# EasyEDA Pro project PCB-print.eprj

# Schematic pi
Board Name: pi; Create Date: 2025-05-02; Page Name: Version2; Project Name: pi; Schematic Name: pi; Update Date: 2025-05-10; Add into BOM: yes; Company: ----; Convert to PCB: yes; Date: 2024-08-29; Draw By: Vlasiuk Dmitro; REV: 2.1; Sheet: 1/1; spicePre: .
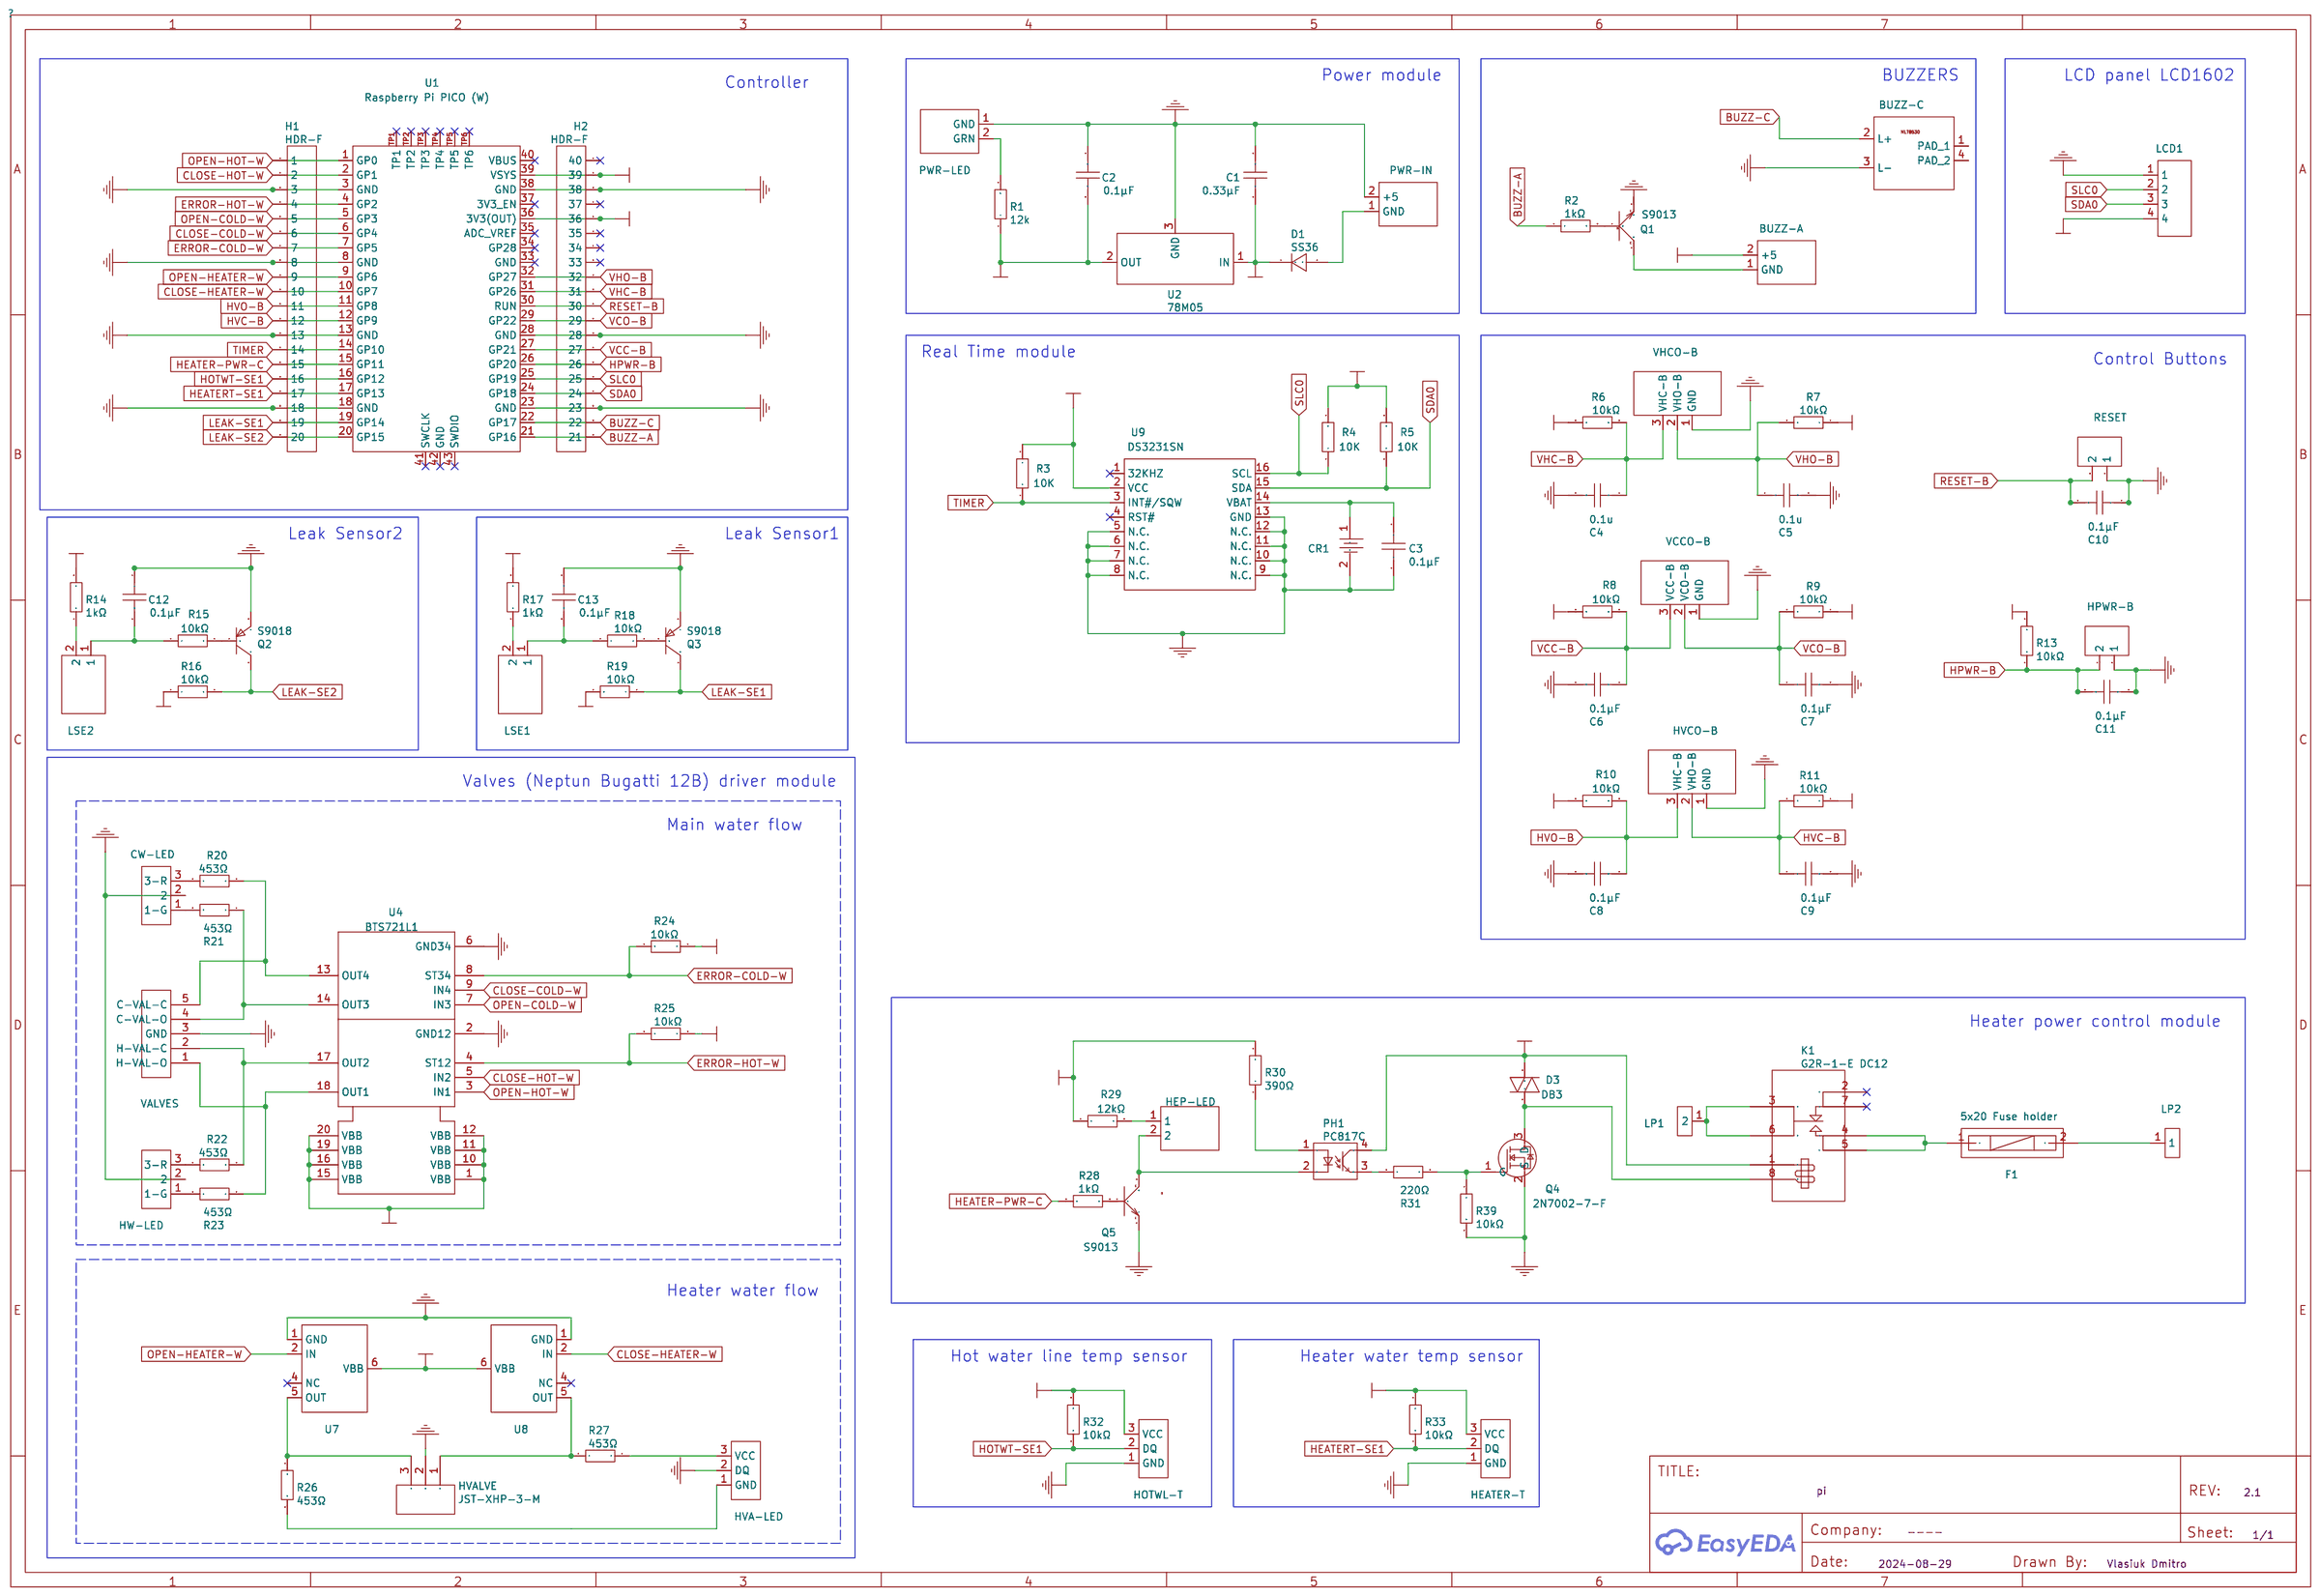
[diagram p0: schematic sheet]

## Parts
BUZZ-A  KF2510
BUZZ-C  BUZZER-MLT8580_MLT-8530
C1  0.33μF
C2  0.1μF
C3  0.1μF
C4  0.1u
C5  0.1u
C6  0.1μF
C7  0.1μF
C8  0.1μF
C9  0.1μF
C10  0.1μF
C11  0.1μF
C12  0.1μF
C13  0.1μF
CR1  KH-CR1220-2
CW-LED  CONN-TH_KF2510-3A
D1  SS36
D3  DB3
F1  5x20 Fuse holder
H1  HDR-F
H2  HDR-F
HEATER-T  CONN-TH_KF2510-3A
HEP-LED  KF2510
HOTWL-T  CONN-TH_KF2510-3A
HPWR-B  HDR-M-2.54_1x2
HVA-LED  CONN-TH_KF2510-3A
HVALVE  JST-XHP-3-M
HVCO-B  HDR-M-2.54_1x3
HW-LED  CONN-TH_KF2510-3A
K1  G2R-1-E DC12
LCD1  TERMINAL_KF2510-4A-
LP1  PCB Spade Terminal - 5.08
LP2  PCB Spade Terminal - 5.08
LSE1  KF2510
LSE2  KF2510
PH1  PC817C
PWR-IN  KF2510
PWR-LED  KF2510
Q1  S9013
Q2  S9018
Q3  S9018
Q4  2N7002-7-F
Q5  S9013
R1  12k
R2  1kΩ
R3  10К
R4  10К
R5  10К
R6  10kΩ
R7  10kΩ
R8  10kΩ
R9  10kΩ
R10  10kΩ
R11  10kΩ
R13  10kΩ
R14  1kΩ
R15  10kΩ
R16  10kΩ
R17  1kΩ
R18  10kΩ
R19  10kΩ
R20  453Ω
R21  453Ω
R22  453Ω
R23  453Ω
R24  10kΩ
R25  10kΩ
R26  453Ω
R27  453Ω
R28  1kΩ
R29  12kΩ
R30  390Ω
R31  220Ω
R32  10kΩ
R33  10kΩ
R39  10kΩ
RESET  HDR-M-2.54_1x2
U1  Raspberry Pi PICO (W)
U2  78M05
U4  BTS721L1
U7  BTS452TATMA1_C5309408
U8  BTS452TATMA1_C5309408
U9  DS3231SN
VALVES  JST-XHP-5-M
VCCO-B  HDR-M-2.54_1x3
VHCO-B  HDR-M-2.54_1x3

## Library data of the parts
BUZZ-A HEP-LED LSE1 LSE2 PWR-IN PWR-LED = KF2510: link: https://www.aliexpress.com/item/1005004114019589.html?spm=a2g0o.order_detail.order_detail_item.13.24e4f19c9nkOaD; Contributor: ryan.yulianto; spicePre: C; spiceSymbolName: B2B-XH-AM (LF)(SN)
BUZZ-C = BUZZER-MLT8580_MLT-8530: Contributor: Paul Walker; spicePre: L; Package Display: No
C1 = 0.33μF: Manufacturer Part: C0805X104K050T; link: https://www.aliexpress.com/item/1005005443849072.html?spm=a2g0o.order_detail.order_detail_item.3.69d8f19csxdjfb; nameAlias: Value; Contributor: LCSC; spicePre: C; spiceSymbolName: C0805-100NF
C2 C3 C6-C13 = 0.1μF: Manufacturer Part: C0805X104K050T; link: https://www.aliexpress.com/item/1005005443849072.html?spm=a2g0o.order_detail.order_detail_item.3.69d8f19csxdjfb; nameAlias: Value; Contributor: LCSC; spicePre: C; spiceSymbolName: C0805-100NF
C4 C5 = 0.1u: Manufacturer Part: C0805X104K050T; link: https://www.aliexpress.com/item/1005005443849072.html?spm=a2g0o.order_detail.order_detail_item.3.69d8f19csxdjfb; nameAlias: Value; Contributor: LCSC; spicePre: C; spiceSymbolName: C0805-100NF
CR1 = KH-CR1220-2: Supplier: LCSC; Supplier Part: C5365933; Manufacturer: kinghelm(金航标); JLCPCB Part Class: Extended Part; Contributor: lcsc; spicePre: U
CW-LED = CONN-TH_KF2510-3A: Manufacturer Part: KF2510; image: //image.lceda.cn/szlcsc/C29275.jpg; spicePre: X
D1 = SS36: Supplier Part: C143203; Supplier: LCSC; Manufacturer: FMS(美丽微); Manufacturer Part: SS36-A; JLCPCB Part Class: Extended Part; Contributor: LCSC; spicePre: D; spiceSymbolName: SS36-A
D3 = DB3: Contributor: tyan; spicePre: D
F1 = 5x20 Fuse holder: Supplier: LCSC; Manufacturer Part: 5x20 BLX-A型 保险丝支架 XC-7; Manufacturer: xcfuse(旭程); Supplier Part: C3131; JLCPCB Part Class: Extended Part; spicePre: F; spiceSymbolName: 5x20 BLX-Atype Fuse holder XC-7
H1 H2 = HDR-F: Supplier Part: C50984; Supplier: LCSC; Contributor: LCEDA_Lib; spicePre: H; spiceSymbolName: HDR-F-2.54_1x20
HEATER-T HOTWL-T HVA-LED HW-LED = CONN-TH_KF2510-3A: Manufacturer Part: KF2510; image: //image.lceda.cn/szlcsc/C29275.jpg; link: https://www.aliexpress.com/item/1005004114019589.html?spm=a2g0o.order_detail.order_detail_item.12.6c826368OURzWV; spicePre: X
HPWR-B RESET = HDR-M-2.54_1x2: Supplier Part: C124375; Supplier: LCSC; Contributor: QW AS; spicePre: J
HVALVE = JST-XHP-3-M: Contributor: slamdunking; spicePre: J
HVCO-B VCCO-B VHCO-B = HDR-M-2.54_1x3: Supplier Part: C180248; Supplier: LCSC; Contributor: Tom Clesius; spicePre: C
K1 = G2R-1-E DC12: JLCPCB Part Class: Extended Part; spicePre: K
LCD1 = TERMINAL_KF2510-4A-: Manufacturer Part: KF2510-4A; image: http://image.lceda.cn/szlcsc/C27542.jpg; spicePre: X; Contributor: Mikhail Malyshev; Package Display: No
LP1 LP2 = PCB Spade Terminal - 5.08: Manufacturer Part: ?; Contributor: themongrel; timeStamp: 1470203039; sourceId: 9XtLFXewO; spicePre: P
PH1 = PC817C: Contributor: RaspAutomacao; spicePre: P
Q1 Q5 = S9013: 305010018; link: https://www.aliexpress.com/item/2012774411.html?spm=a2g0o.order_list.order_list_main.13.21ef1802c8Vd1i; spicePre: Q; spiceSymbolName: SMD-TRANSISTORS-NPN-25V-500MA-S9013(SOT-23)
Q2 Q3 = S9018: Supplier: LCSC; Supplier Part: C3027191; Manufacturer: 晶导微电子; JLCPCB Part Class: Extended Part; Contributor: lcsc; spicePre: Q; spiceSymbolName: S9018_C3027191
Q4 = 2N7002-7-F: Manufacturer: Diodes Incorporated; Contributor: ewick91; spicePre: Q
R1 = 150: Supplier: Add New Supplier; JLCPCB Part Class: 1% High Precision SMD Resistor; link: https://www.aliexpress.com/item/1005002991966154.html?spm=a2g0o.order_list.order_list_main.18.21ef1802djWI3U; nameAlias: Value; spicePre: R; spiceSymbolName: RC1206FR-071KL; Contributor: dulajekanayake123
R2 R14 R17 = 1kΩ: Supplier: Add New Supplier; Manufacturer Part: 1% High Precision SMD Resistor; link: https://www.aliexpress.com/item/1005002991966154.html?spm=a2g0o.order_list.order_list_main.18.21ef1802djWI3U; nameAlias: Value; spicePre: R; spiceSymbolName: RC1206FR-071KL; Contributor: dulajekanayake123
R3-R5 = 10К: Supplier: Add New Supplier; JLCPCB Part Class: 1% High Precision SMD Resistor; link: https://www.aliexpress.com/item/1005002991966154.html?spm=a2g0o.order_list.order_list_main.18.21ef1802djWI3U; nameAlias: Value; spicePre: R; spiceSymbolName: RC1206FR-071KL; Contributor: dulajekanayake123
R6-R11 R13 R15 R16 R18 R19 R24 R25 R32 R33 = 10kΩ: Supplier: Add New Supplier; Manufacturer Part: 1% High Precision SMD Resistor; link: https://www.aliexpress.com/item/1005002991966154.html?spm=a2g0o.order_list.order_list_main.18.21ef1802djWI3U; nameAlias: Value; spicePre: R; spiceSymbolName: RC1206FR-071KL; Contributor: dulajekanayake123
R20-R23 R26 R27 = 453Ω: Manufacturer Part: 1% High Precision SMD Resistor; link: https://www.aliexpress.com/item/1005002991966154.html?spm=a2g0o.order_list.order_list_main.18.21ef1802djWI3U; nameAlias: Value; spicePre: R; spiceSymbolName: RC1206FR-071KL; Contributor: dulajekanayake123
R28 = 1kΩ: Manufacturer Part: 1% High Precision SMD Resistor; link: https://www.aliexpress.com/item/1005002991966154.html?spm=a2g0o.order_list.order_list_main.18.21ef1802djWI3U; nameAlias: Value; spicePre: R; spiceSymbolName: RC1206FR-071KL; Contributor: dulajekanayake123
R29 = 150kΩ: Manufacturer Part: 1% High Precision SMD Resistor; link: https://www.aliexpress.com/item/1005002991966154.html?spm=a2g0o.order_list.order_list_main.18.21ef1802djWI3U; nameAlias: Value; spicePre: R; spiceSymbolName: RC1206FR-071KL; Contributor: dulajekanayake123
R30 = 390Ω: Manufacturer Part: ?; nameAlias: Value(Ω); spicePre: R; spiceSymbolName: Resistor
R31 = 220Ω: Manufacturer Part: ?; nameAlias: Value(Ω); spicePre: R; spiceSymbolName: Resistor
R39 = 10kΩ: Manufacturer Part: ?; nameAlias: Value(Ω); spicePre: R; spiceSymbolName: Resistor
U1 = Raspberry Pi PICO (W): Supplier: LCSC; Supplier Part: C7203002; Manufacturer: Raspberry Pi(树莓派); Manufacturer Part: PICO; JLCPCB Part Class: Extended Part; link: https://www.rcscomponents.kiev.ua/product/raspberry%20pi%20pico%20wh.html; Contributor: lcsc; spicePre: U; spiceSymbolName: PICO
U2 = 78M05: Manufacturer: null; link: https://www.aliexpress.com/item/1005006385741830.html?spm=a2g0o.order_list.order_list_main.63.3da61802HSJtR8; Contributor: lcsc; spicePre: U; spiceSymbolName: 78M05_C9900084420
U4 = BTS721L1: link: https://www.rcscomponents.kiev.ua/product/bts721l1_28084.html; Manufacturer: BTS721L1 Infineon; spicePre: U
U7 U8 = BTS452TATMA1_C5309408: Supplier: LCSC; Supplier Part: C5309408; Manufacturer: Infineon(英飞凌); Manufacturer Part: BTS452TATMA1; Contributor: lcsc; spicePre: U
U9 = DS3231SN: Supplier: LCSC; Supplier Part: C722469; Manufacturer: ADI(亚德诺)/MAXIM(美信); Manufacturer Part: DS3231SN#; JLCPCB Part Class: Extended Part; Contributor: lcsc; spicePre: U; spiceSymbolName: DS3231SN#_C722469
VALVES = JST-XHP-5-M: Contributor: slamdunking; spicePre: J

## Nets
+3.3V: H2.5(36) HEATER-T.3(VCC) HOTWL-T.3(VCC) R3.2 R4.2 R5.2 R6.1 R7.1 R8.1 R9.1 R10.1 R11.1 R13.2 R16.1 R19.2 R24.2 R25.2 R32.2 R33.2 U1.36(3V3(OUT)) U9.2(VCC)
+5V: BUZZ-A.2(+5) C2.2 H2.2(39) LCD1.4 R1.1 R14.2 R17.2 R29.1 R30.2 U1.39(VSYS) U2.2(OUT)
+12V: C1.2 D1.1 D3.2 K1.1 PH1.4 U2.1(IN) U4.1(VBB) U4.10(VBB) U4.11(VBB) U4.12(VBB) U4.15(VBB) U4.16(VBB) U4.19(VBB) U4.20(VBB) U7.6(VBB) U8.6(VBB)
GND: BUZZ-C.3(L-) C1.1 C2.1 C3.2 C4.2 C5.2 C6.2 C7.2 C8.2 C9.2 C10.1 C11.1 C12.1 C13.1 CR1.2 CW-LED.2 H1.3 H1.8 H1.13 H1.18 H2.3(38) H2.13(28) H2.18(23) HEATER-T.1(GND) HOTWL-T.1(GND) HPWR-B.1 HVA-LED.2(DQ) HVALVE.2 HVCO-B.1(GND) HW-LED.2 LCD1.1 PWR-IN.2(+5) PWR-LED.1(GND) Q1.2(E) Q2.2(E) Q3.2(E) Q4.2(S) Q5.2(E) R39.2 RESET.1 U1.3(GND) U1.8(GND) U1.13(GND) U1.18(GND) U1.23(GND) U1.28(GND) U1.38(GND) U2.3(GND) U4.2(GND12) U4.6(GND34) U7.1(GND) U8.1(GND) U9.5(N.C.) U9.6(N.C.) U9.7(N.C.) U9.8(N.C.) U9.9(N.C.) U9.10(N.C.) U9.11(N.C.) U9.12(N.C.) U9.13(GND) VALVES.3(GND) VCCO-B.1(GND) VHCO-B.1(GND)
VCC-B: C6.1 H2.14(27) R8.2 U1.27(GP21) VCCO-B.3(VCC-B)
BUZZ-A: H2.20(21) R2.1 U1.21(GP16)
BUZZ-C: BUZZ-C.2(L+) H2.19(22) U1.22(GP17)
CLOSE-COLD-W: H1.6 U1.6(GP4) U4.9(IN4)
CLOSE-HEATER-W: H1.10 U1.10(GP7) U8.2(IN)
CLOSE-HOT-W: H1.2 U1.2(GP1) U4.5(IN2)
ERROR-COLD-W: H1.7 R24.1 U1.7(GP5) U4.8(ST34)
ERROR-HOT-W: H1.4 R25.1 U1.4(GP2) U4.4(ST12)
HEATER-PWR-C: H1.15 R28.1 U1.15(GP11)
HEATERT-SE1: H1.17 HEATER-T.2(DQ) R33.1 U1.17(GP13)
HOTWT-SE1: H1.16 HOTWL-T.2(DQ) R32.1 U1.16(GP12)
HPWR-B: C11.2 H2.15(26) HPWR-B.2 R13.1 U1.26(GP20)
HVC-B: C9.1 H1.12 HVCO-B.2(VHO-B) R11.2 U1.12(GP9)
HVO-B: C8.1 H1.11 HVCO-B.3(VHC-B) R10.2 U1.11(GP8)
LEAK-SE1: H1.19 Q3.3(C) R19.1 U1.19(GP14)
LEAK-SE2: H1.20 Q2.3(C) R16.2 U1.20(GP15)
OPEN-COLD-W: H1.5 U1.5(GP3) U4.7(IN3)
OPEN-HEATER-W: H1.9 U1.9(GP6) U7.2(IN)
OPEN-HOT-W: H1.1 U1.1(GP0) U4.3(IN1)
RESET-B: C10.2 H2.11(30) RESET.2 U1.30(RUN)
SDA0: H2.17(24) LCD1.3 R5.1 U1.24(GP18) U9.15(SDA)
SLC0: H2.16(25) LCD1.2 R4.1 U1.25(GP19) U9.16(SCL)
TIMER: H1.14 R3.1 U1.14(GP10) U9.3(INT#/SQW)
VCO-B: C7.1 H2.12(29) R9.2 U1.29(GP22) VCCO-B.2(VCO-B)
VHC-B: C4.1 H2.10(31) R6.2 U1.31(GP26) VHCO-B.3(VHC-B)
VHO-B: C5.1 H2.9(32) R7.2 U1.32(GP27) VHCO-B.2(VHO-B)
C3_1: C3.1 CR1.1 U9.14(VBAT)
CW-LED_1: CW-LED.1(1-G) R21.2
CW-LED_3: CW-LED.3(3-R) R20.1
D1_2: D1.2 PWR-IN.1(GND)
F1_1: F1.1 K1.4 K1.5
HEP-LED_1: HEP-LED.1 R29.2
HVA-LED_1: HVA-LED.1(GND) R26.2
HVA-LED_3: HVA-LED.3(VCC) R27.1
HW-LED_1: HW-LED.1(1-G) R23.2
HW-LED_3: HW-LED.3(3-R) R22.1
K1_8: D3.1 K1.8 Q4.3(D)
LSE1_1: C13.2 LSE1.1 R18.1
LSE1_2: LSE1.2 R17.1
LSE2_1: C12.2 LSE2.1 R15.1
LSE2_2: LSE2.2 R14.1
PH1_3: PH1.3 R31.1
Q1_1: Q1.1(B) R2.2
Q1_3: BUZZ-A.1(GND) Q1.3(C)
Q2_1: Q2.1(B) R15.2
Q3_1: Q3.1(B) R18.2
Q5_3: HEP-LED.2 PH1.2 Q5.3(C)
R1_2: PWR-LED.2(GRN) R1.2
R28_2: Q5.1(B) R28.2
R30_1: PH1.1 R30.1
R31_2: Q4.1(G) R31.2 R39.1
U4_13: R20.2 U4.13(OUT4) VALVES.5(C-VAL-C)
U4_14: R21.1 U4.14(OUT3) VALVES.4(C-VAL-O)
U4_17: R22.2 U4.17(OUT2) VALVES.2(H-VAL-C)
U4_18: R23.1 U4.18(OUT1) VALVES.1(H-VAL-O)
U7_5: HVALVE.3 R26.1 U7.5(OUT)
U8_5: HVALVE.1 R27.2 U8.5(OUT)
VOLPROBE1: F1.2 LP2.1
VOLPROBE2: K1.3 K1.6 LP1.1(2)

Not connected (* = marked no-connect by the designer): BUZZ-C 1(PAD) 4(PAD_2); H2 1(40)* 4(37)* 6(35)* 7(34)* 8(33)*; K1 2* 7*; U1 33(GND)* 34(GP28)* 35(ADC_VREF)* 37(3V3_EN)* 40(VBUS)* 41(SWCLK)* 42(GND)* 43(SWDIO)* TP1* TP2* TP3* TP4* TP5* TP6*; U7 4(NC)*; U8 4(NC)*; U9 1(32KHZ)* 4(RST#)*

## Notes on the sheet
- Controller
- Power module
- BUZZERS
- LCD panel LCD1602
- Real Time module
- Control Buttons
- Leak Sensor2
- Leak Sensor1
- Valves (Neptun Bugatti 12В) driver module
- Main water flow
- Heater power control module
- Heater water flow
- Hot water line temp sensor
- Heater water temp sensor

# Board PCB_pi-print
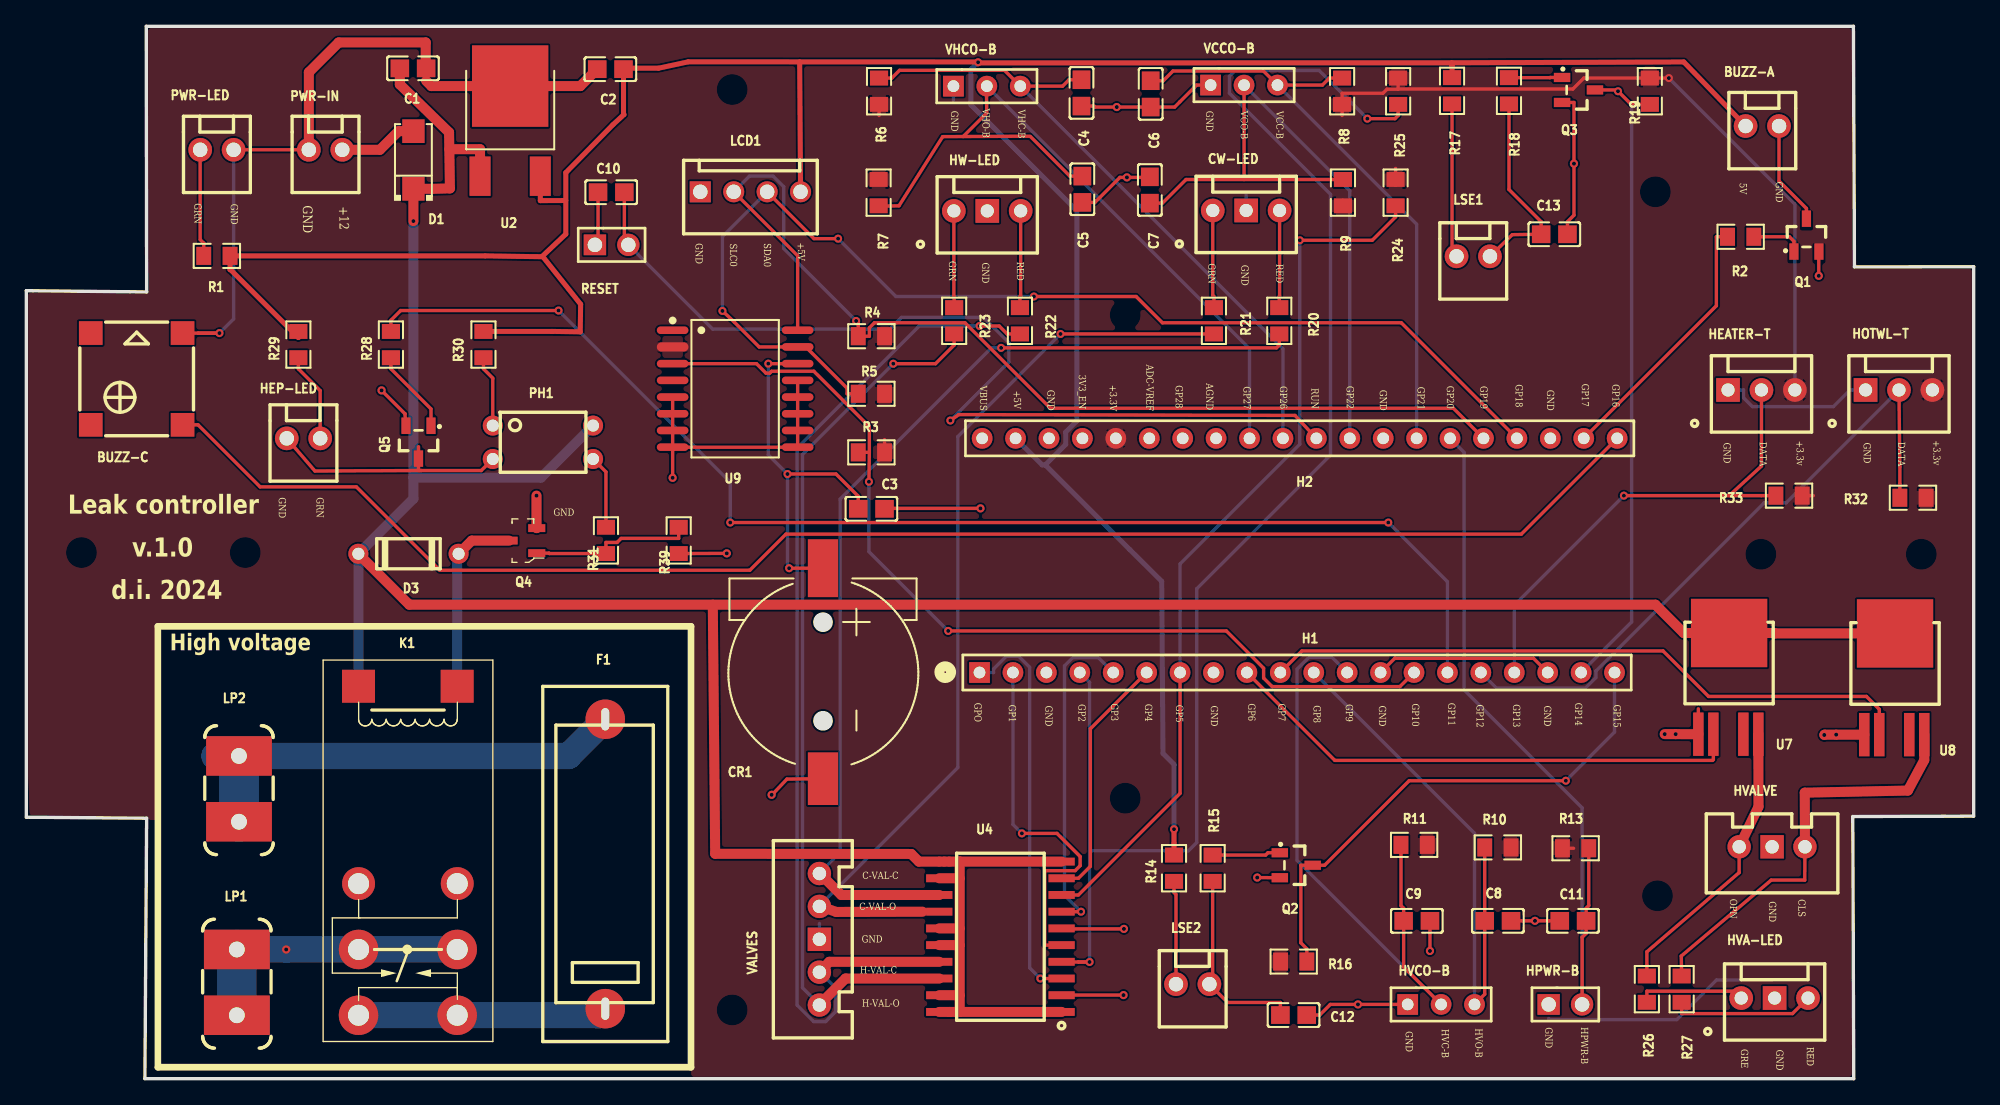
[diagram p1: board, top side]
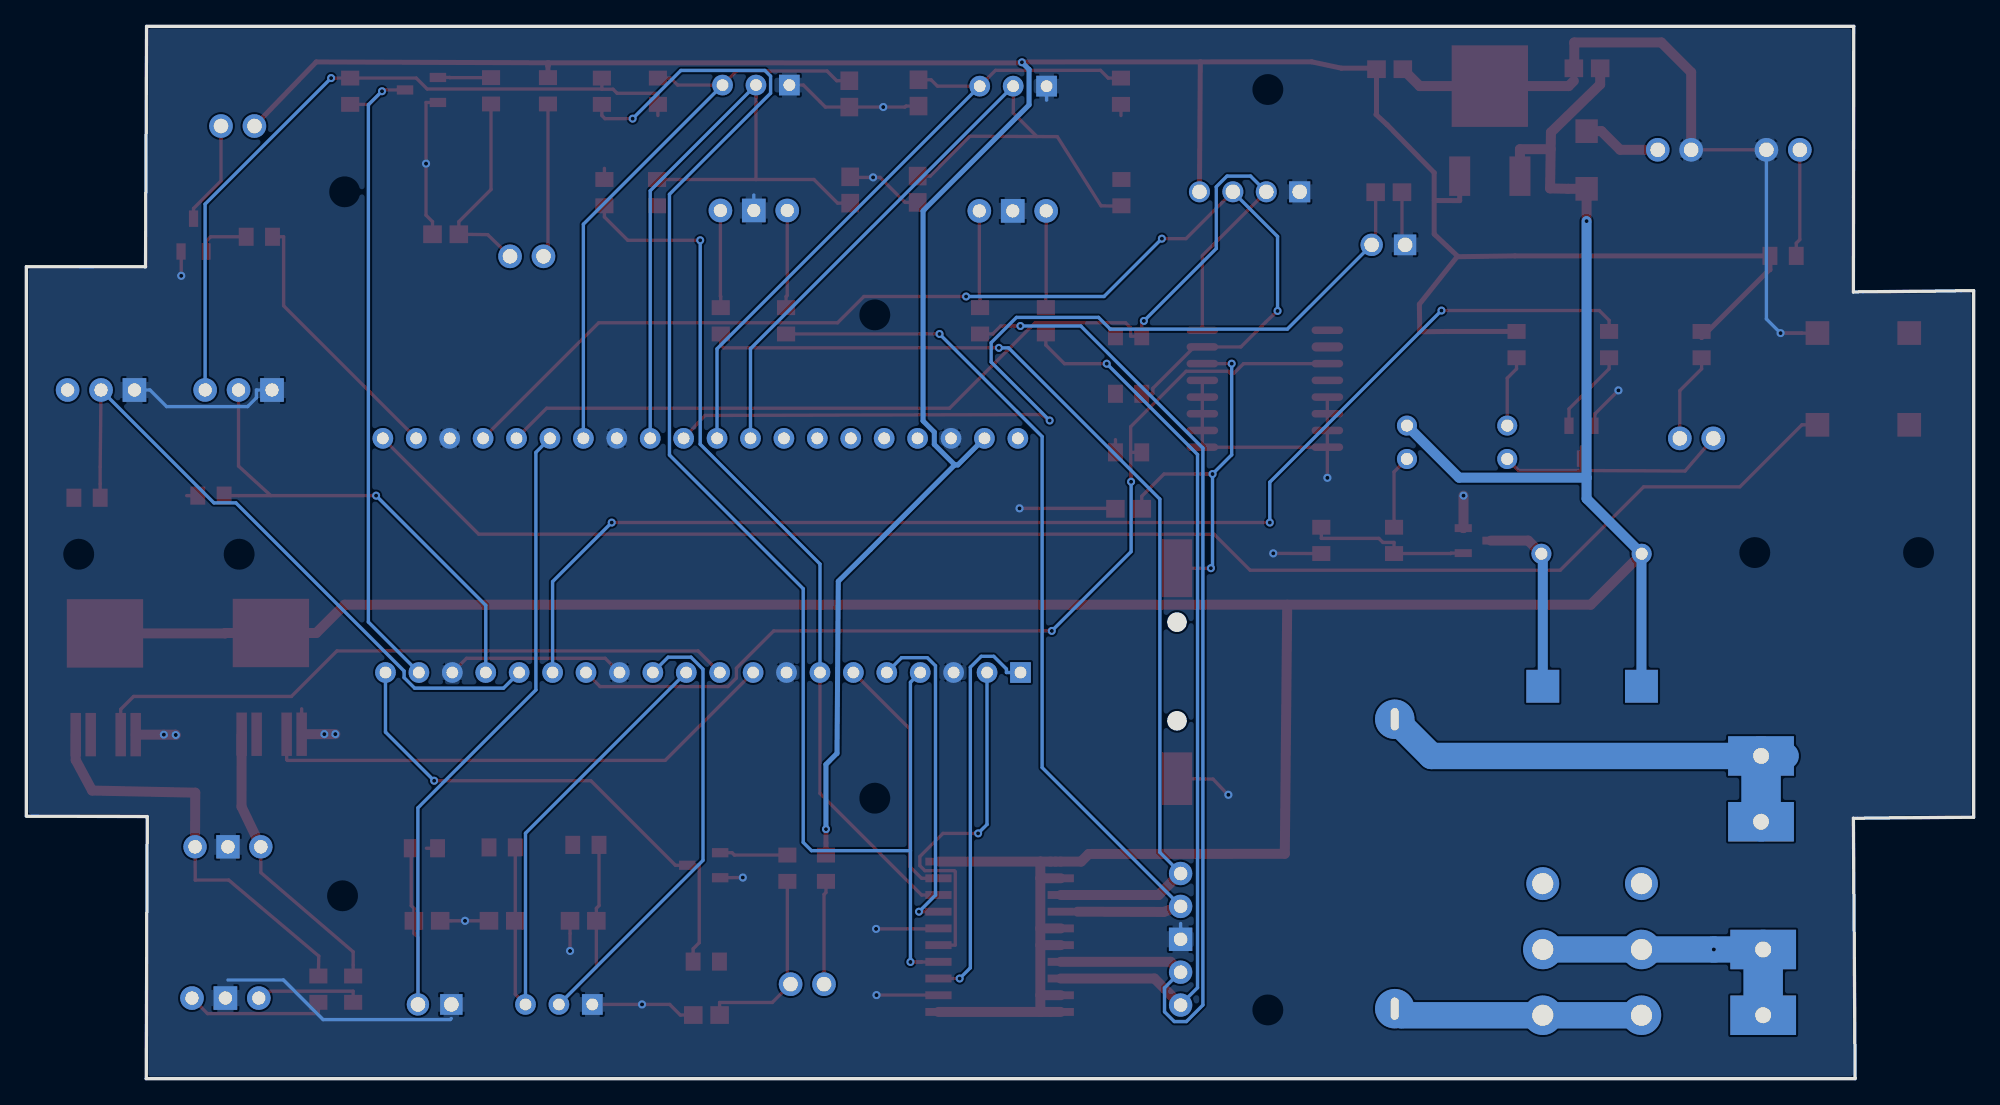
[diagram p2: board, bottom side, seen from below]

Outline 148 x 80 mm; copper layers: Top Layer, Bottom Layer. Coordinates in mm from the lower left corner of the outline.
Outline path: 0,59.9 9.14,59.81 9.12,80 138.86,80 138.94,61.71 148,61.72 148,19.96 138.81,19.93 138.88,0 9.01,0 9.14,19.8 0,19.88 0,59.9
Stack: Top Layer 0.035mm / Dielectric1 1.51mm FR4 er 4.5 / Bottom Layer 0.035mm

## Design rules (mm)
spacing 5: track to track 0.17, other pairs 0 to 0.17
spacing 12: track to track 0.17, other pairs 0 to 0.17
spacing 220: track to track 0.25, other pairs 0 to 0.25
spacing Default (default): track to track 0.152, other pairs 0 to 0.17
track width 5: min 0.38, default 0.38, max 25.4
track width 12: min 0.76, default 0.76, max 25.4
track width 220: min 2, default 2, max 25.4
track width Default (default): min 0.254, default 0.254, max 25.4
differential pair differentialPair (default): width min 0.127, default 0.254, max 2.54; gap min 0.152, default 0.152
via 5 (default): diameter min 0.61, default 0.61, max 100.025; hole min 0.3, default 0.3, max 59.995
via 12: diameter min 0.61, default 0.61, max 100.025; hole min 0.3, default 0.3, max 59.995
via 220: diameter min 0.61, default 0.61, max 100.025; hole min 0.3, default 0.3, max 59.995
via Default: diameter min 0.61, default 0.61, max 100.025; hole min 0.305, default 0.305, max 59.995
net +5V uses 5
net +12V uses 12
net VOLPROBE2 uses 220
net F1_1 uses 220
net VOLPROBE1 uses 220
pour e170 uses gge25621
pour e648 uses gge62130
pour e672 uses gge62130

## Placement (name value [footprint] x y rotation side)
BUZZ-A  KF2510  [CONN-TH_KF2510-2A]  131.94 72.42 0 top
BUZZ-C  BUZZER-MLT8580_MLT-8530  [BUZ-SMD_4P-L8.5-W8.5_FUET-8530-05]  8.39 53.19 270 top
C1  0.33μF  [C0805]  29.39 76.81 180 top
C2  0.1μF  [C0805]  44.39 76.74 0 top
C3  0.1μF  [C0805]  64.23 43.32 0 top
C4  0.1u  [C0805]  80.19 74.94 270 top
C5  0.1u  [C0805]  80.26 67.61 270 top
C6  0.1μF  [C0805]  85.45 74.86 270 top
C7  0.1μF  [C0805]  85.39 67.56 90 top
C8  0.1μF  [C0805]  111.84 12 0 top
C9  0.1μF  [C0805]  105.68 12 0 top
C10  0.1μF  [C0805]  44.45 67.39 0 top
C11  0.1μF  [C0805]  117.54 12 0 top
C12  0.1μF  [C0805]  96.31 4.84 180 top
C13  0.1μF  [C0805]  116.13 64.19 180 top
CR1  KH-CR1220-2  [BAT-SMD_CR1220-2]  60.55 30.81 270 top
CW-LED  -  [CONN-TH_KF2510-3A]  92.71 66 0 top
D1  SS36  [SMA_L4.4-W2.6-LS5.0-RD]  29.42 69.84 90 top
D3  -  [DB3]  27.77 39.9 180 top
F1  5x20 Fuse holder  [FUSE-TH_L22.6-W9.0]  44 16.32 90 top
H1  HDR-F  [HDR-F-2.54_1X20#2]  96.57 30.88 0 top
H2  HDR-F  [HDR-F-2.54_1X20]  96.77 48.68 0 top
HEATER-T  -  [CONN-TH_KF2510-3A#2]  131.87 52.36 0 top
HEP-LED  KF2510  [CONN-TH_KF2510-2A]  21.06 48.68 0 top
HOTWL-T  -  [CONN-TH_KF2510-3A#2]  142.32 52.36 0 top
HPWR-B  HDR-M-2.54_1x2  [HDR-M-2.54_1X2]  116.97 5.65 0 top
HVA-LED  -  [CONN-TH_KF2510-3A]  132.87 6.13 0 top
HVALVE  -  [JST-XHP-3-M]  137.68 20.13 270 top
HVCO-B  HDR-M-2.54_1x3  [HDR-M-2.54_1X3]  107.52 5.65 0 top
HW-LED  -  [CONN-TH_KF2510-3A]  73.03 65.97 0 top
K1  G2R-1-E DC12  [G2R-1-E]  29 17.32 270 top
LCD1  TERMINAL_KF2510-4A-  [CONN-TH_4P-P2.54_KF2510-4A]  55.03 67.42 0 top
LP1  PCB Spade Terminal - 5.08  [DJ6111-6.3]  16 7.32 90 top
LP2  PCB Spade Terminal - 5.08  [DJ6111-6.3]  16.16 22.03 90 top
LSE1  KF2510  [CONN-TH_KF2510-2A]  109.97 62.52 0 top
LSE2  KF2510  [CONN-TH_KF2510-2A]  88.65 7.19 0 top
PH1  -  [PC817C]  35.45 44.06 270 top
PWR-IN  KF2510  [CONN-TH_KF2510-2A]  22.74 70.61 0 top
PWR-LED  KF2510  [CONN-TH_KF2510-2A]  14.48 70.61 0 top
Q1  S9013  [SOT-23-3_L2.9-W1.5-P1.90-LS2.6-BR]  135.29 64.13 270 top
Q2  S9018  [SOT-23-3_L2.9-W1.5-P1.90-LS2.6-BR]  96.52 16.23 180 top
Q3  S9018  [SOT-23-3_L2.9-W1.5-P1.90-LS2.6-BR]  117.97 75.16 180 top
Q4  2N7002-7-F  [SOT-23-3]  37.74 40.9 180 top
Q5  S9013  [SOT-23-3_L2.9-W1.5-P1.90-LS2.6-BR]  29.81 48.39 90 top
R1  12k  [R0805]  14.48 62.55 180 top
R2  1kΩ  [R0805]  130.29 64 0 top
R3  10К  [R0805]  64.23 47.61 0 top
R4  10К  [R0805]  64.23 56.44 0 top
R5  10К  [R0805]  64.23 52.06 0 top
R6  10kΩ  [R0805]  64.81 75.06 90 top
R7  10kΩ  [R0805]  64.77 67.36 90 top
R8  10kΩ  [R0805]  100 75.06 90 top
R9  10kΩ  [R0805]  100.06 67.36 270 top
R10  10kΩ  [R0805]  111.84 17.58 180 top
R11  10kΩ  [R0805]  105.47 17.77 0 top
R13  10kΩ  [R0805]  117.75 17.52 180 top
R14  1kΩ  [R0805]  87.23 16 90 top
R15  10kΩ  [R0805]  90.16 16 90 top
R16  10kΩ  [R0805]  96.32 8.9 0 top
R17  1kΩ  [R0805]  108.35 75.1 90 top
R18  10kΩ  [R0805]  112.68 75.1 90 top
R19  10kΩ  [R0805]  123.39 75.06 90 top
R20  453Ω  [R0805]  95.23 57.61 270 top
R21  453Ω  [R0805]  90.26 57.61 90 top
R22  453Ω  [R0805]  75.52 57.61 270 top
R23  453Ω  [R0805]  70.52 57.61 90 top
R24  10kΩ  [R0805]  104.06 67.36 90 top
R25  10kΩ  [R0805]  104.26 75.06 90 top
R26  453Ω  [R0805]  123.16 6.81 270 top
R27  453Ω  [R0805]  125.81 6.81 90 top
R28  1kΩ  [R0805]  27.71 55.81 270 top
R29  12kΩ  [R0805]  20.68 55.81 270 top
R30  390Ω  [R0805]  34.74 55.81 90 top
R31  220Ω  [R0805]  44.05 40.92 270 top
R32  10kΩ  [R0805]  143.39 44.16 0 top
R33  10kΩ  [R0805]  133.97 44.32 0 top
R39  10kΩ  [R0805]  49.58 40.92 270 top
RESET  HDR-M-2.54_1x2  [HDR-M-2.54_1X2]  44.48 63.39 0 top
U2  78M05  [TO-252-2_L6.6-W6.1-P4.57-LS9.9-BR_78M05]  36.77 72.03 270 top
U4  BTS721L1  [SOIC127P1030X265-20N-1]  74.03 9.71 180 top
U7  BTS452TATMA1_C5309408  [TO-252-5-11_L6.5-W6.2-P1.14-LS10.0-TL]  129.36 30.03 90 top
U8  BTS452TATMA1_C5309408  [TO-252-5-11_L6.5-W6.2-P1.14-LS10.0-TL]  141.97 30 90 top
U9  DS3231SN  [SOIC-16_L10.3-W7.5-P1.27-LS10.3-BL]  53.87 52.45 270 top
VALVES  -  [JST-XHP-5-M]  62.77 3.1 180 top
VCCO-B  HDR-M-2.54_1x3  [HDR-M-2.54_1X3]  92.55 75.53 0 top
VHCO-B  HDR-M-2.54_1x3  [HDR-M-2.54_1X3]  73 75.45 0 top

## Footprints (pads in the part's own frame, mm; a bottom-side part is the same pattern mirrored in y, then rotated)
BAT-SMD_CR1220-2
  rect 4.4x2.3 smd: 1(-8,0)
  rect 4x2.3 smd: 2(8,0)
BUZ-SMD_4P-L8.5-W8.5_FUET-8530-05
  rect 1.8x1.8 smd: 1(3.488,-3.488) 2(3.488,3.488) 3(-3.488,3.488) 4(-3.488,-3.488)
C0805
  rect 1.41x1.35 smd: 1(-1,0) 2(1,0)
CONN-TH_4P-P2.54_KF2510-4A
  rect 1.6x1.6 hole 1.1: 1(-3.81,0)
  round 1.6 hole 1.1: 2(-1.27,0) 3(1.27,0) 4(3.81,0)
CONN-TH_KF2510-2A
  round 1.8 hole 1.1: 1(1.27,0) 2(-1.27,0)
CONN-TH_KF2510-3A
  round 1.8 hole 1: 1(-2.54,0) 3(2.54,0)
  rect 1.8x1.8 hole 1: 2(0,0)
CONN-TH_KF2510-3A#2
  rect 1.8x1.8 hole 1: 1(-2.54,0)
  round 1.8 hole 1: 2(0,0) 3(2.54,0)
DB3
  round 1.524 hole 0.914: 1(-5.08,0) 2(2.54,0)
DJ6111-6.3
  rect 3x5 hole 1.2: 1(-2.5,0) 1(2.5,0)
FUSE-TH_L22.6-W9.0
  round 3 hole 1.7x0.6: 1(-11,0) 2(11,0)
G2R-1-E
  custom 2.5x2.5 hole 1.6: 1(-12.501,-3.752) 8(-12.501,3.749)
  round 2.5 hole 1.6: 2(2.493,-3.749) 7(2.493,3.752)
  round 3 hole 1.6: 3(7.5,-3.749) 4(12.501,-3.752) 5(12.501,3.749) 6(7.5,3.749)
HDR-F-2.54_1X20
  round 1.575 hole 0.889: 1(-24.13,0) 2(-21.59,0) 3(-19.05,0) 4(-16.51,0) 5(-13.97,0) 6(-11.43,0) 7(-8.89,0) 8(-6.35,0) 9(-3.81,0) 10(-1.27,0) 11(1.27,0) 12(3.81,0) 13(6.35,0) 14(8.89,0) 15(11.43,0) 16(13.97,0) 17(16.51,0) 18(19.05,0) 19(21.59,0) 20(24.13,0)
HDR-F-2.54_1X20#2
  rect 1.575x1.575 hole 0.889: 1(-24.13,0)
  round 1.575 hole 0.889: 2(-21.59,0) 3(-19.05,0) 4(-16.51,0) 5(-13.97,0) 6(-11.43,0) 7(-8.89,0) 8(-6.35,0) 9(-3.81,0) 10(-1.27,0) 11(1.27,0) 12(3.81,0) 13(6.35,0) 14(8.89,0) 15(11.43,0) 16(13.97,0) 17(16.51,0) 18(19.05,0) 19(21.59,0) 20(24.13,0)
HDR-M-2.54_1X2
  rect 1.7x1.575 hole 1.1: 1(-1.27,0)
  round 1.7 hole 1.1: 2(1.27,0)
HDR-M-2.54_1X3
  rect 1.575x1.575 hole 0.889: 1(-2.54,0)
  round 1.575 hole 0.889: 2(0,0) 3(2.54,0)
JST-XHP-3-M
  round 1.778 hole 1.021x1.016: 1(2.5,-2.5) 3(2.5,-7.5)
  rect 1.778x1.778 hole 1.021x1.016: 2(2.5,-5)
JST-XHP-5-M
  round 1.778 hole 1.021x1.016: 1(2.5,-2.5) 2(2.5,-5) 4(2.5,-10) 5(2.5,-12.5)
  rect 1.778x1.778 hole 1.021x1.016: 3(2.5,-7.5)
PC817C
  round 1.524 hole 0.914: 1(-5.588,0) 2(-3.048,0) 3(-3.048,7.62) 4(-5.588,7.62)
R0805
  rect 1.133x1.377 smd: 1(-1,0) 2(1,0)
SMA_L4.4-W2.6-LS5.0-RD
  rect 1.8x1.7 smd: 1(-2.192,0) 2(2.192,0)
SOIC127P1030X265-20N-1
  rect 1.999x0.6 smd: 1(-4.648,4.636) 2(-4.648,3.365) 3(-4.648,2.095) 4(-4.648,0.826) 5(-4.648,-0.445) 6(-4.648,-1.714) 7(-4.648,-2.985) 8(-4.648,-4.255) 9(-4.648,-5.524) 10(-4.648,-6.795) 11(4.648,-6.795) 12(4.648,-5.524) 13(4.648,-4.255) 14(4.648,-2.985) 15(4.648,-1.714) 16(4.648,-0.445) 17(4.648,0.826) 18(4.648,2.095) 19(4.648,3.365) 20(4.648,4.636)
SOIC-16_L10.3-W7.5-P1.27-LS10.3-BL
  oval 0.574x2.401 smd: 1(-4.445,-4.75) 3(-1.905,-4.75) 4(-0.635,-4.75) 5(0.635,-4.75) 6(1.905,-4.75) 7(3.175,-4.75) 8(4.445,-4.75) 9(4.445,4.75) 10(3.175,4.75) 11(1.905,4.75) 12(0.635,4.75) 13(-0.635,4.75) 14(-1.905,4.75) 15(-3.175,4.75) 16(-4.445,4.75)
  oval 0.7x2.401 smd: 2(-3.175,-4.75)
SOT-23-3
  rect 1.3x0.6 smd: 1(-1.05,0.95) 2(-1.05,-0.95) 3(1.05,0)
SOT-23-3_L2.9-W1.5-P1.90-LS2.6-BR
  rect 1.25x0.7 smd: 1(1.25,-0.95) 2(1.25,0.95) 3(-1.25,0)
TO-252-2_L6.6-W6.1-P4.57-LS9.9-BR_78M05
  rect 3x1.6 smd: 1(3.424,-2.29) 2(3.424,2.29)
  rect 6.2x5.8 smd: 3(-3.424,0)
TO-252-5-11_L6.5-W6.2-P1.14-LS10.0-TL
  rect 3.3x0.8 smd: 1(-3.848,2.28) 2(-3.848,1.14) 4(-3.848,-1.14) 5(-3.848,-2.28)
  rect 5.2x5.8 smd: 6(3.848,-0.057)

## Nets
As in the schematic, except:
+3.3V: H2.5 HEATER-T.3 HOTWL-T.3 R3.2 R4.2 R5.2 R6.1 R7.2 R8.1 R9.2 R10.1 R11.2 R13.2 R16.1 R19.2 R24.2 R25.2 R32.2 R33.2 U9.2
BUZZ-A: H2.19 R2.1
BUZZ-C: BUZZ-C.2 H2.20
HVC-B: C9.1 H1.12 HVCO-B.2 R11.1
VCO-B: C7.1 H2.12 R9.1 VCCO-B.2
VHO-B: C5.1 H2.9 R7.1 VHCO-B.2

Pads without a net: H2 1 4 6 7 8; K1 2 7; U7 4; U8 4; U9 1 4

## Via types
v1: diameter 0.61, hole 0.3, Top Layer to Bottom Layer, 3 vias
v2: diameter 0.62, hole 0.31, Top Layer to Bottom Layer, 21 vias
v3: diameter 0.61, hole 0.305, Top Layer to Bottom Layer, 28 vias

## Routing (per net, layer and track width the routed paths; a pad name or vN(x,y) marks a point on that pad's centre or on a via; arc(x,y) is an arc through that point)
+3.3V: length 60.7
  Top Layer w0.254: R6.1 64.81,73.22 ; R25.2 104.26,75.23 ; 104.26,75.23 104.26,75.22 103.41,75.22 103.1,74.91 100,74.91 R8.1 100,73.22 ; 104.26,75.23 117.53,75.23 118.37,76.06 R19.2 v3(124.84,76.06) ; 104.06,67.93 R24.2 104.06,69.2 ; R13.2 117.59,17.52 ; R9.2 100.06,66.78 ; 135.81,44.32 R33.2 ; R3.2 65.23,48.58
  Bottom Layer w0.254: HEATER-T.3 134.41,66.49 v3(124.84,76.06)
+5V: length 238
  Top Layer w0.38: R29.1 20.68,56.34 15.52,61.5 15.48,61.5 R1.1 34.86,62.55 39.19,62.48 ; 108.35,77.02 108.29,77.23 72.33,77.22 v1(72.33,77.27) ; 108.35,77.02 R17.2 ; 108.35,77.02 108.39,77.23 125.97,77.29 BUZZ-A.2 ; v1(87.23,18.97) R14.2 ; LCD1.4 58.78,77.31 ; 39.26,62.48 42.13,58.87 42.1,56.77 39.95,56.81 34.74,56.81 ; 72.32,77.29 50.31,77.3 48.05,76.82 45.38,76.82 ; 39.19,62.5 41,64.2 41,68.87 44.58,72.52 45.42,73.29 45.39,73.32 C2.2 45.39,76.55 ; 41,66.76 39.06,66.75 U2.2
  Bottom Layer w0.38: v1(72.33,77.27) 71.79,76.72 71.79,74.03 79.84,65.97 79.84,50 78.99,49.15 78.99,48.22 77.43,46.66 77.21,46.66 H2.2 ; 77.42,46.68 83.86,40.22 86.29,37.81 86.39,24.73 87.23,23.89 v1(87.23,18.97)
+12V: length 264.4
  Top Layer w0.76: U4.12 70.93,15.23 ; D3.2 29.11,36.03 123.81,36.03 125.96,33.88 U7.6 132.86,33.88 132.9,33.85 U8.6 ; C1.2 28.39,75.58 32.13,71.94 32.19,67.68 30.82,67.65 D1.1 v1(29.42,65.19) ; 70.93,6.34 70.93,10.15 ; 70.93,6.34 70.93,5.07 ; 70.93,6.34 U4.19 ; 70.93,10.15 70.93,11.42 ; 70.93,10.15 U4.16 ; 70.93,16.5 U4.11 67.83,16.5 67.25,17.08 52.35,17.1 52.17,36.03 ; 70.93,16.5 70.93,15.23 ; 70.93,16.5 U4.10 ; 70.93,5.07 U4.1 ; 70.93,5.07 U4.20 ; 70.93,11.42 70.93,15.23 ; 70.93,11.42 U4.15 ; U2.1 34.48,70.66 32.15,70.66
  Bottom Layer w0.76: K1.1 25.25,39.89 D3.2 29.42,44.09 29.42,45.69 39.11,45.69 PH1.4 ; 29.42,45.69 v1(29.42,65.19)
GND: length 216.1
  Top Layer w0.254: v2(27,52.32) 28.78,50.54 28.77,50.55 Q5.2 ; 136.22,63.16 136.22,61.03 ; C10.1 43.45,63.62 RESET.1 ; U9.8 U9.9 U9.10 U9.11 U9.12 U9.13 ; U9.8 U9.7 U9.6 U9.5 ; U9.8 v2(49.12,45.68) ; BUZZ-C.3 11.88,56.68 v3(14.68,56.68) 13.06,56.68 13.05,56.68 ; U7.1 127.08,28.11 ; CR1.2 57.81,22.77 56.64,21.55 ; 136.24,63.2 136.24,62.75 ; C4.2 81.15,73.94 81.22,73.86 v2(82.87,73.86) C6.2 87.27,73.86 87.66,74.25 88.94,75.53 VCCO-B.1 ; Q2.2 v2(93.55,15.29) ; Q3.2 117.62,74.21 v2(117.62,69.56) 117.62,65.64 117.13,65.15 C13.1 ; 106.68,11.04 v2(106.68,9.71) ; C12.1 98.29,4.84 99.1,5.65 v2(101.21,5.65) HVCO-B.1 ; C1.1 30.39,75.85 ; 65.22,43.32 65.26,43.36 v2(72.52,43.36) ; U4.6 78.72,11.39 v2(83.42,11.39) ; v2(83.39,6.35) 78.69,6.35 U4.2 ; 139.69,26.15 139.69,25.31 ; C11.1 v2(114.66,12) C8.2 ; H1.18 114.54,31.96 104,31.96 H1.13 ; 84.9,68.55 84.87,68.52 v2(83.65,68.52) 83.12,68.52 81.21,66.61 C5.2 ; C9.2 106.68,11.05 ; U2.3 38.36,75.46 ; 53.42,39.94 R39.2 49.58,39.5 ; C7.2 84.9,68.56 ; PWR-LED.1 PWR-IN.2
  Top Layer w0.76: PWR-IN.2 21.47,76.5 23.74,78.77 30.36,78.77 30.36,76.78 ; v2(136.65,26.13) 136.67,26.15 v2(137.55,26.15) 139.69,26.15 ; 30.39,75.85 30.78,75.46 U2.3 42.1,75.46 C2.1 ; v2(124.52,26.19) v2(125.35,26.19) U7.1 ; 38.79,41.85 38.77,41.87 v2(38.77,44.32)
  Bottom Layer w0.254: CW-LED.2 92.71,67.18 ; 70.46,74.39 VHCO-B.1 ; 115.7,4.58 115.78,4.49 125.44,4.49 128.45,7.5 132.68,7.5 ; PWR-LED.1 15.75,57.75 v3(14.68,56.68) ; HOTWL-T.1 138.6,52.36 137.34,51.09 131.18,51.09 130.51,51.77 130.51,52.36 HEATER-T.1 ; 60.27,10.63 60.27,11.8
  vias: v2(53.23,39.94) v2(56.64,21.58) v2(136.23,61.03)
VCC-B: length 46.8
  Top Layer w0.254: C6.1 86.41,75.86 87.14,76.6 94.02,76.6 VCCO-B.3 98.5,75.53 99.03,76.06 R8.2
  Bottom Layer w0.254: H2.14 105.66,64.96 VCCO-B.3
BUZZ-A: length 20.3
  Top Layer w0.254: R2.1 128.44,64 128.44,58.76 H2.19
BUZZ-C: length 117.8
  Top Layer w0.254: BUZZ-C.2 13.05,49.71 17.77,44.99 25.09,44.99 31.42,38.66 54.99,38.66 57.73,41.4 113.62,41.4 H2.20
C3_1: length 28
  Top Layer w0.254: U9.14 v3(56.39,54.36) ; CR1.1 v3(57.97,38.81) ; C3.1 63.23,44.28 61.54,45.97 v3(57.85,45.97)
  Bottom Layer w0.254: v3(56.39,54.36) 56.39,47.42 v3(57.85,45.97) 57.85,38.93 v3(57.97,38.81)
CLOSE-COLD-W: length 19.1
  Top Layer w0.254: H1.6 80.87,26.6 80.87,16.14 79.96,15.23 U4.9
CLOSE-HEATER-W: length 50
  Top Layer w0.254: H1.10 96.95,32.52 124.39,32.52 127.85,29.06 139.85,29.06 140.83,28.08 U8.2
CLOSE-HOT-W: length 28.1
  Top Layer w0.254: U4.5 77.4,10.15 ; 77.4,10.16 77.4,15.74 77.47,15.81 79.71,15.81 80.09,16.2 80.09,16.89 78.33,18.65 v3(75.66,18.65)
  Bottom Layer w0.254: v3(75.66,18.65) 74.98,19.33 H1.2
CW-LED_1: length 7.4
  Top Layer w0.254: CW-LED.1 90.17,59.55 90.26,59.46 R21.2
CW-LED_3: length 7.4
  Top Layer w0.254: CW-LED.3 95.25,59.48 95.23,59.46 R20.1
D1_2: length 6
  Top Layer w0.76: PWR-IN.1 26.87,70.61 28.29,72.03 29.42,72.03
ERROR-COLD-W: length 66.9
  Top Layer w0.254: R24.1 104.06,65.51 102.29,63.73 v3(96.79,63.73) ; H1.7 87.68,21.69 79.96,13.96 U4.8
  Bottom Layer w0.254: v3(96.79,63.73) 96.79,48.23 87.68,39.13 H1.7
ERROR-HOT-W: length 114.8
  Top Layer w0.254: 79.96,8.88 79.97,8.87 v3(80.81,8.87) 78.69,8.87 U4.4 ; v3(101.92,72.98) 104.02,72.98 104.26,73.22 R25.1
  Bottom Layer w0.254: v3(101.92,72.98) 98.25,76.65 91.87,76.65 91.44,76.21 91.44,74.91 99.12,67.23 99.12,47.41 88.95,37.25 88.95,17.96 88.33,17.33 80.81,17.33 ; 80.81,17.33 80.81,30.13 H1.4 ; 80.81,17.33 80.81,8.87
F1_1: length 19
  Bottom Layer w2: F1.1 43.5,4.82 K1.5 K1.4
HEATER-PWR-C: length 98.7
  Top Layer w0.254: v3(53.5,42.28) v3(103.51,42.28) ; R28.1 27.71,57.65 28.45,58.39 v3(40.45,58.39)
  Bottom Layer w0.254: v3(103.51,42.28) 108,37.78 H1.15 ; v3(40.45,58.39) 53.5,45.34 v3(53.5,42.28)
HEATERT-SE1: length 37.6
  Top Layer w0.254: 131.87,52.35 131.87,46.57 129.41,44.32 ; v3(121.42,44.32) R33.1
  Bottom Layer w0.254: H1.17 113.08,35.99 v3(121.42,44.32)
HEP-LED_1: length 6.8
  Top Layer w0.254: HEP-LED.1 22.33,52.3 20.68,53.96 R29.2
HOTWT-SE1: length 50.1
  Top Layer w0.254: 142.39,44.16 142.39,45.22 142.39,46.52 142.32,52.35
  Bottom Layer w0.254: HOTWL-T.2 133.74,43.77 132.07,43.77 119.29,30.99 119.29,30.49 118.48,29.69 111.74,29.69 H1.16
HPWR-B: length 59.3
  Top Layer w0.254: R13.1 118.75,13.16 118.54,12.95 C11.2 118.54,11.05 118.24,10.74 HPWR-B.2
  Bottom Layer w0.254: HPWR-B.2 118.24,20.59 109.27,29.55 109.27,47.61 H2.15
HVA-LED_1: length 8.2
  Top Layer w0.254: R26.2 123.16,6.65 ; HVA-LED.1 129.81,6.65 123.16,6.65
HVA-LED_3: length 10.9
  Top Layer w0.254: HVA-LED.3 134.23,4.95 125.82,4.95 125.81,4.96 R27.1
HVC-B: length 48.1
  Top Layer w0.254: R11.1 104.47,13.16 104.68,12.95 C9.1 104.68,8.49 HVCO-B.2
  Bottom Layer w0.254: H1.12 99.22,32.04 97.48,32.04 96.57,31.13 96.57,16.59 HVCO-B.2
HVO-B: length 42.6
  Top Layer w0.254: HVCO-B.3 110.84,6.42 C8.1 R10.2
  Bottom Layer w0.254: HVCO-B.3 110.06,18.66 H1.11
HW-LED_1: length 7.4
  Top Layer w0.254: HW-LED.1 70.49,59.48 70.52,59.46 R23.2
HW-LED_3: length 7.4
  Top Layer w0.254: HW-LED.3 75.57,59.51 75.52,59.46 R22.1
K1_8: length 14.4
  Top Layer w0.76: Q4.3 33.85,40.9 D3.1
  Bottom Layer w0.76: K1.8 32.75,39.8 D3.1
LEAK-SE1: length 50.8
  Top Layer w0.254: R19.1 121.97,74.06 v3(120.97,75.06) 120.87,75.16 Q3.3
  Bottom Layer w0.254: v3(120.97,75.06) 122,74.03 122,34.72 H1.19
LEAK-SE2: length 40.1
  Top Layer w0.254: v3(117,22.65) 105.1,22.65 98.67,16.23 Q2.3 96.86,16.23 96.86,10.33 97.32,9.87 R16.2
  Bottom Layer w0.254: v3(117,22.65) 120.7,26.35 H1.20
LSE1_1: length 15.5
  Top Layer w0.254: R18.1 112.68,67.59 115.13,65.15 C13.2 112.94,64.16 LSE1.1
LSE1_2: length 11.7
  Top Layer w0.254: R17.1 108.35,62.86 LSE1.2
LSE2_1: length 14.8
  Top Layer w0.254: C12.2 95.31,5.79 91.31,5.79 LSE2.1 90.16,7.43 R15.1
LSE2_2: length 7.9
  Top Layer w0.254: R14.1 87.23,14.16 87.38,14.01 LSE2.2
OPEN-COLD-W: length 25.1
  Top Layer w0.254: U4.7 v3(80.16,12.69)
  Bottom Layer w0.254: H1.5 81.47,32.01 79.53,32.01 78.9,31.39 78.9,13.95 v3(80.16,12.69)
OPEN-HEATER-W: length 40.2
  Top Layer w0.254: H1.9 99.44,24.2 128.16,24.2 128.22,24.26 U7.2
OPEN-HOT-W: length 30.4
  Top Layer w0.254: U4.3 v3(77.07,7.61)
  Bottom Layer w0.254: H1.1 73.51,30.88 73.51,31.14 74.47,32.11 75.43,32.11 76.25,31.28 76.25,8.43 v3(77.07,7.61)
PH1_3: length 5.6
  Top Layer w0.254: PH1.3 44.05,46.13 R31.1
Q1_1: length 4.1
  Top Layer w0.254: 134.34,62.75 134.34,63.65 133.99,64 R2.2
Q1_3: length 8
  Top Layer w0.254: BUZZ-A.1 133.21,68.24 135.29,66.15 135.29,65.25
Q2_1: length 5.2
  Top Layer w0.254: R15.2 94.19,17 94.36,17.18 Q2.1
Q3_1: length 4
  Top Layer w0.254: R18.2 115.8,76.1 115.81,76.11 Q3.1
Q5_3: length 19.2
  Top Layer w0.254: HEP-LED.2 21.94,46.19 30.03,46.23 ; 29.81,48.04 Q5.3 29.81,46.23 34.58,46.23 PH1.2
R1_2: length 8.2
  Top Layer w0.254: PWR-LED.2 13.21,63.79 13.48,63.52 R1.2
R28_2: length 6.4
  Top Layer w0.254: R28.2 27.71,53.96 30.76,50.91 Q5.1
R30_1: length 5.5
  Top Layer w0.254: R30.1 34.74,53.96 35.45,53.25 PH1.1
R31_2: length 12.6
  Top Layer w0.254: R39.1 49.58,41.07 45.21,41.07 44.9,40.77 44.05,40.77 R31.2 39.75,39.92 39.72,39.95 Q4.1
RESET-B: length 73.3
  Top Layer w0.254: RESET.2 45.45,63.69 C10.2 ; 98.04,48.68 96.42,50.42 70.87,50.48 v3(70.23,50.03)
  Bottom Layer w0.254: v3(70.23,50.03) 74.67,54.48 74.67,55.95 72.75,57.87 66.51,57.87 65.62,56.98 52.16,56.98 RESET.2
SDA0: length 88.4
  Top Layer w0.254: v3(76.58,59.46) 84.35,59.46 86.35,57.46 104.5,57.46 H2.17 ; 58.62,55.63 55.7,55.63 53.81,57.52 v3(52.91,58.36) ; U9.15 59.24,55.63 62.38,52.49 62.38,52.06 R5.1 ; v3(61.7,63.86) 59.86,63.86 LCD1.3
  Bottom Layer w0.254: v3(76.58,59.46) 66.09,59.46 v3(61.7,63.86) ; v3(52.91,58.36) 52.91,64.02 LCD1.3
SLC0: length 82.8
  Top Layer w0.254: LCD1.2 58.62,62.56 U9.16 ; H2.16 108.45,50.97 77.83,50.97 71.34,57.46 64.46,57.46 64.07,57.08 64.07,56.44 R4.1 63.23,57.44 v3(63.07,57.6)
  Bottom Layer w0.254: v3(63.07,57.6) 57.56,63.11 57.56,67.8 56.75,68.61 54.96,68.61 LCD1.2
TIMER: length 74
  Top Layer w0.254: 64.07,47.61 R3.1 ; 64.07,47.61 v3(64.04,45.38) ; 64.07,47.61 64.07,49.56 59.85,53.78 56.64,53.78 56.5,53.63 56.21,53.63 55.49,54.36 U9.3 ; v3(70.06,34.04) 91.2,34.04 94.03,31.2 94.03,30.46 94.68,29.81 104.39,29.81 H1.14
  Bottom Layer w0.254: v3(70.06,34.04) 64.04,40.06 v3(64.04,45.38)
U4_13: length 78
  Top Layer w0.254: R20.2 95.23,55.77 95.01,55.56 v3(74.09,55.56)
  Top Layer w0.76: U4.13 61.94,13.96 60.27,15.63
  Bottom Layer w0.254: v3(74.09,55.56) 73.35,55.56 61.85,44.06 61.85,17.21 60.27,15.63
U4_14: length 71.9
  Top Layer w0.254: R21.1 v3(78.6,56.61) ; U4.14 68.11,12.69
  Top Layer w0.76: 68.11,12.69 61.55,12.68 60.27,13.13
  Bottom Layer w0.254: 60.27,13.13 70.8,23.65 70.8,48.81 v3(78.6,56.61)
U4_17: length 80.1
  Top Layer w0.254: R22.2 74.55,56.61 73.94,57.22 v3(72.45,57.22)
  Top Layer w0.76: 60.27,8.13 61.03,8.88 U4.17
  Bottom Layer w0.254: v3(72.45,57.22) 67.86,57.22 58.58,47.94 58.58,5.6 59.84,4.34 60.75,4.34 61.5,5.08 61.5,6.91 60.27,8.13
U4_18: length 68.1
  Top Layer w0.254: v3(65.89,54.35) 69.1,54.35 70.52,55.77 R23.1
  Top Layer w0.76: U4.18 62.26,7.61 60.27,5.63
  Bottom Layer w0.254: v3(65.89,54.35) 58.99,47.45 58.99,6.91 60.27,5.63
U7_5: length 21.9
  Top Layer w0.254: 123.16,8.65 123.16,9.65 130.18,15.67 130.18,17.63 ; R26.1 123.16,8.65
  Top Layer w0.76: HVALVE.3 131.65,20.68 U7.5
U8_5: length 32.1
  Top Layer w0.254: 135.18,17.63 135.16,15.1 132.61,15.1 125.77,9.32 R27.2
  Top Layer w0.76: U8.5 144.25,24.22 143,21.9 135.16,21.74 HVALVE.1
VCO-B: length 52.8
  Top Layer w0.254: VCCO-B.2 92.55,68.36 ; 92.55,68.36 88.14,68.36 86.34,66.56 C7.1 ; 92.55,68.36 R9.1
  Bottom Layer w0.254: H2.12 100.58,67.5 VCCO-B.2
VHC-B: length 51.4
  Top Layer w0.254: R6.2 65.77,76.06 66.36,76.65 74.34,76.65 VHCO-B.3 78.76,75.45 79.24,75.94 C4.1
  Bottom Layer w0.254: VHCO-B.3 95.5,55.49 H2.10
VHO-B: length 59.8
  Top Layer w0.254: C5.1 79.3,68.61 76.32,71.61 ; 71.2,71.62 72.99,73.41 72.97,75.55 ; 64.77,66.32 66.32,66.36 69.65,71.61 76.27,71.65 ; VHCO-B.2 73,74.92
  Bottom Layer w0.254: VHCO-B.2 92.96,55.49 H2.9
VOLPROBE1: length 35.9
  Bottom Layer w2: F1.2 41.21,24.53 LP2.1 14.29,24.53
  Bottom Layer w3: LP2.1 LP2.1
VOLPROBE2: length 21.7
  Bottom Layer w2: 25.25,9.82 v2(19.75,9.82) 16,9.82 ; 25.25,9.82 32.75,9.82
  Bottom Layer w3: 16,9.82 LP1.1

## Copper pours and planes (outline as drawn; the poured copper is in the pictures)
+3.3V on Top Layer: 52.81,-0.23 50.64,-0.26 50.71,33.71 50.64,34.55 9.81,34.45 9.81,19.77 0.39,19.52 -0.19,35.52 -0.19,59.39 0.13,59.71 9.45,59.71 9.29,59.87 9.29,79.71 9.54,80.23 138.84,80.23 139.52,79.55 139.52,61.74 139.68,61.58 148.48,61.58 148.13,61.23 148.13,20.26 147.97,20.1 138.65,20.1 139.52,19.23 139.52,-0.23
GND on Bottom Layer: 0.19,-0.97 0.19,79.81 0,80 -0.16,80 2.23,80.32 1.9,80 148,80 148.52,79.48 148.52,-0.61 148.68,-0.77 0.39,-0.77

Small or netless copper shapes (teardrops, artwork), in the pictures only: 1 on Top Layer

## Text on the board
Top Silkscreen Layer: High voltage | Leak controller | d.i. 2024 | v.1.0 | GND | C-VAL-O | H-VAL-C | H-VAL-O | C-VAL-C | GRN | SLC0 | SDA0 | +5V | GPO | VBUS | VHO-B | GP1 | RED | VHC-B | GP2 | 3V3_EN | +3.3V | GP3 | GP4 | ADC-VREF | GP28 | GP5 | AGND | VCO-B | GP27 | GP6 | VCC-B | GP7 | GP26 | RUN | GP8 | GP9 | GP22 | GP10 | GP21 | HVC-B | GP20 | GP11 | HVO-B | GP12 | GP19 | GP13 | GP18 | GP14 | HPWR-B | GP17 | GP16 | GP15 | OPN | 5V | GRE | DATA | +3.3v | CLS | +12
